# Altium project MB1134.PrjPCB
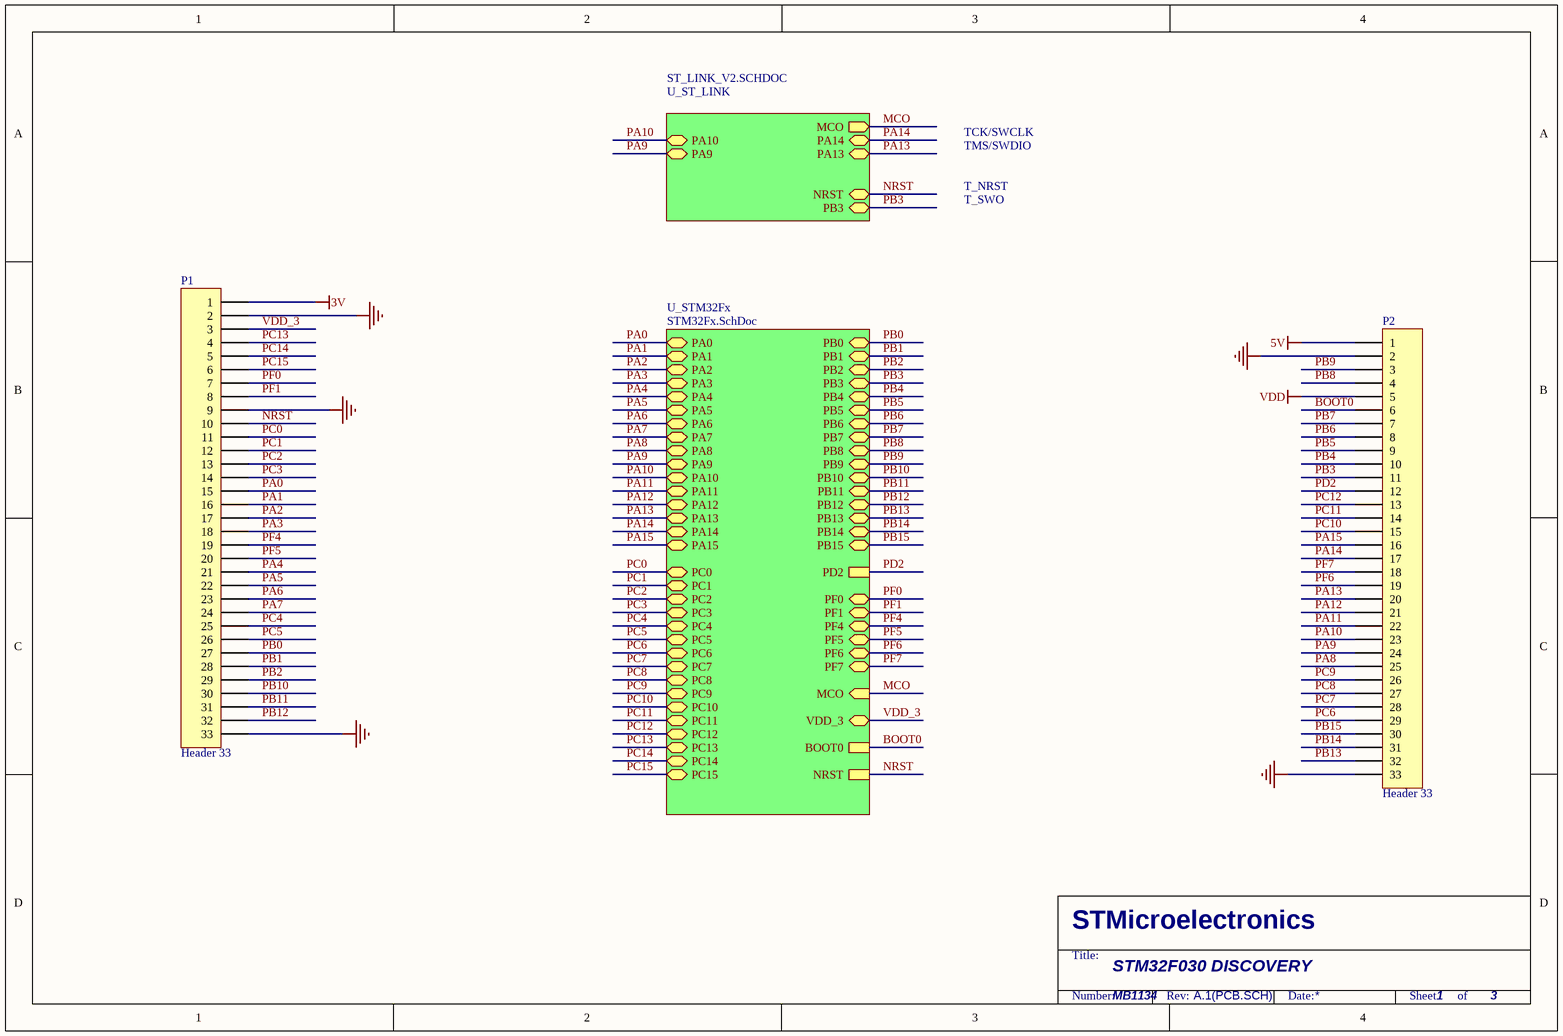
[diagram p0: MB1134.SchDoc]
3 sheets, 102 parts. Net scope: hierarchical (ports join the sheet entries above them; power ports are global).
Sheets:
  MB1134.SchDoc
    U_ST_LINK = ST_LINK_V2.SCHDOC
    U_STM32Fx = STM32Fx.SchDoc

## Sheet MB1134.SchDoc
size A4; DocumentNumber: 1; Revision: A.1(PCB.SCH); SheetNumber: 1; SheetTotal: 3; PageSetup: Record=PageOptions|CenterHorizontal=True|CenterVertical=True|PrintScale=1.00|XCorrection=1.00|YCorrection=1.00|PrintKind=1|BorderSize=5000000|LeftOffset=0|BottomOffset=0|Orientation=2|PaperLength=1000|PaperWidth=1000|Scale=100|PaperSource=15|PrintQuality=1200|MediaType=1|DitherType=10|PaperKind=A4|PrintScaleMode=1

### Parts
P1  Header 33  [HDR1X33]
P2  Header 33  [HDR1X33]

### Sub-sheets
U_ST_LINK = ST_LINK_V2.SCHDOC: PA13, PA14, NRST, PB3, MCO (out), PA10, PA9
U_STM32Fx = STM32Fx.SchDoc: PA13, PA14, PA15 (bidir), PA12 (bidir), PA0 (bidir), PA1 (bidir), PA2 (bidir), PA3 (bidir), PA4 (bidir), PA5 (bidir), PA6 (bidir), PA7 (bidir), PA8 (bidir), PA9, PA10, PA11 (bidir), PB12 (bidir), PB0 (bidir), PB1 (bidir), PB2 (bidir), PB3, PB4 (bidir), PB5 (bidir), PB6 (bidir), PB7 (bidir), PB8 (bidir), PB9 (bidir), PB10 (bidir), PB11 (bidir), PB13 (bidir), PB14 (bidir), PB15 (bidir), PC3 (bidir), PC15 (bidir), PC14 (bidir), PC13 (bidir), PC12 (bidir), PC11 (bidir), PC10 (bidir), PC9 (bidir), PC8 (bidir), PC7 (bidir), PC6 (bidir), PC5 (bidir), PC4 (bidir), PC2 (bidir), PC1 (bidir), PC0 (bidir), PD2, BOOT0, NRST, MCO (in), VDD_3, PF7, PF6, PF5, PF4, PF1, PF0

### Nets
3V: P1.1
5V: P2.1
GND: P1.2 P1.9 P1.33 P2.2 P2.33
VDD: P2.5
BOOT0: P2.6 ; sheet U_STM32Fx/BOOT0
MCO: sheet U_ST_LINK/MCO, sheet U_STM32Fx/MCO
NRST: P1.10 ; sheet U_ST_LINK/NRST, sheet U_STM32Fx/NRST
PA0: P1.15 ; sheet U_STM32Fx/PA0
PA1: P1.16 ; sheet U_STM32Fx/PA1
PA2: P1.17 ; sheet U_STM32Fx/PA2
PA3: P1.18 ; sheet U_STM32Fx/PA3
PA4: P1.21 ; sheet U_STM32Fx/PA4
PA5: P1.22 ; sheet U_STM32Fx/PA5
PA6: P1.23 ; sheet U_STM32Fx/PA6
PA7: P1.24 ; sheet U_STM32Fx/PA7
PA8: P2.25 ; sheet U_STM32Fx/PA8
PA9: P2.24 ; sheet U_ST_LINK/PA9, sheet U_STM32Fx/PA9
PA10: P2.23 ; sheet U_ST_LINK/PA10, sheet U_STM32Fx/PA10
PA11: P2.22 ; sheet U_STM32Fx/PA11
PA12: P2.21 ; sheet U_STM32Fx/PA12
PA13: P2.20 ; sheet U_ST_LINK/PA13, sheet U_STM32Fx/PA13
PA14: P2.17 ; sheet U_ST_LINK/PA14, sheet U_STM32Fx/PA14
PA15: P2.16 ; sheet U_STM32Fx/PA15
PB0: P1.27 ; sheet U_STM32Fx/PB0
PB1: P1.28 ; sheet U_STM32Fx/PB1
PB2: P1.29 ; sheet U_STM32Fx/PB2
PB3: P2.11 ; sheet U_ST_LINK/PB3, sheet U_STM32Fx/PB3
PB4: P2.10 ; sheet U_STM32Fx/PB4
PB5: P2.9 ; sheet U_STM32Fx/PB5
PB6: P2.8 ; sheet U_STM32Fx/PB6
PB7: P2.7 ; sheet U_STM32Fx/PB7
PB8: P2.4 ; sheet U_STM32Fx/PB8
PB9: P2.3 ; sheet U_STM32Fx/PB9
PB10: P1.30 ; sheet U_STM32Fx/PB10
PB11: P1.31 ; sheet U_STM32Fx/PB11
PB12: P1.32 ; sheet U_STM32Fx/PB12
PB13: P2.32 ; sheet U_STM32Fx/PB13
PB14: P2.31 ; sheet U_STM32Fx/PB14
PB15: P2.30 ; sheet U_STM32Fx/PB15
PC0: P1.11 ; sheet U_STM32Fx/PC0
PC1: P1.12 ; sheet U_STM32Fx/PC1
PC2: P1.13 ; sheet U_STM32Fx/PC2
PC3: P1.14 ; sheet U_STM32Fx/PC3
PC4: P1.25 ; sheet U_STM32Fx/PC4
PC5: P1.26 ; sheet U_STM32Fx/PC5
PC6: P2.29 ; sheet U_STM32Fx/PC6
PC7: P2.28 ; sheet U_STM32Fx/PC7
PC8: P2.27 ; sheet U_STM32Fx/PC8
PC9: P2.26 ; sheet U_STM32Fx/PC9
PC10: P2.15 ; sheet U_STM32Fx/PC10
PC11: P2.14 ; sheet U_STM32Fx/PC11
PC12: P2.13 ; sheet U_STM32Fx/PC12
PC13: P1.4 ; sheet U_STM32Fx/PC13
PC14: P1.5 ; sheet U_STM32Fx/PC14
PC15: P1.6 ; sheet U_STM32Fx/PC15
PD2: P2.12 ; sheet U_STM32Fx/PD2
PF0: P1.7 ; sheet U_STM32Fx/PF0
PF1: P1.8 ; sheet U_STM32Fx/PF1
PF4: P1.19 ; sheet U_STM32Fx/PF4
PF5: P1.20 ; sheet U_STM32Fx/PF5
PF6: P2.19 ; sheet U_STM32Fx/PF6
PF7: P2.18 ; sheet U_STM32Fx/PF7
VDD_3: P1.3 ; sheet U_STM32Fx/VDD_3

### Notes on the sheet
- TCK/SWCLK
- TMS/SWDIO
- T_SWO
- T_NRST
- STM32F030 DISCOVERY
- MB1134
- 1
- STMicroelectronics
- Title:
- Number:
- Rev:
- Date:
- Sheet       of

### Library data of the parts
P1 P2 = Header 33: Header, 33-Pin; LatestRevisionDate: 17-Jul-2002; LatestRevisionNote: Re-released for DXP Platform.; Publisher: Altium Limited

## Sheet ST_LINK_V2.SCHDOC
size A4; DocumentNumber: 2; Revision: A.1(PCB.SCH); SheetNumber: 2; SheetTotal: 3
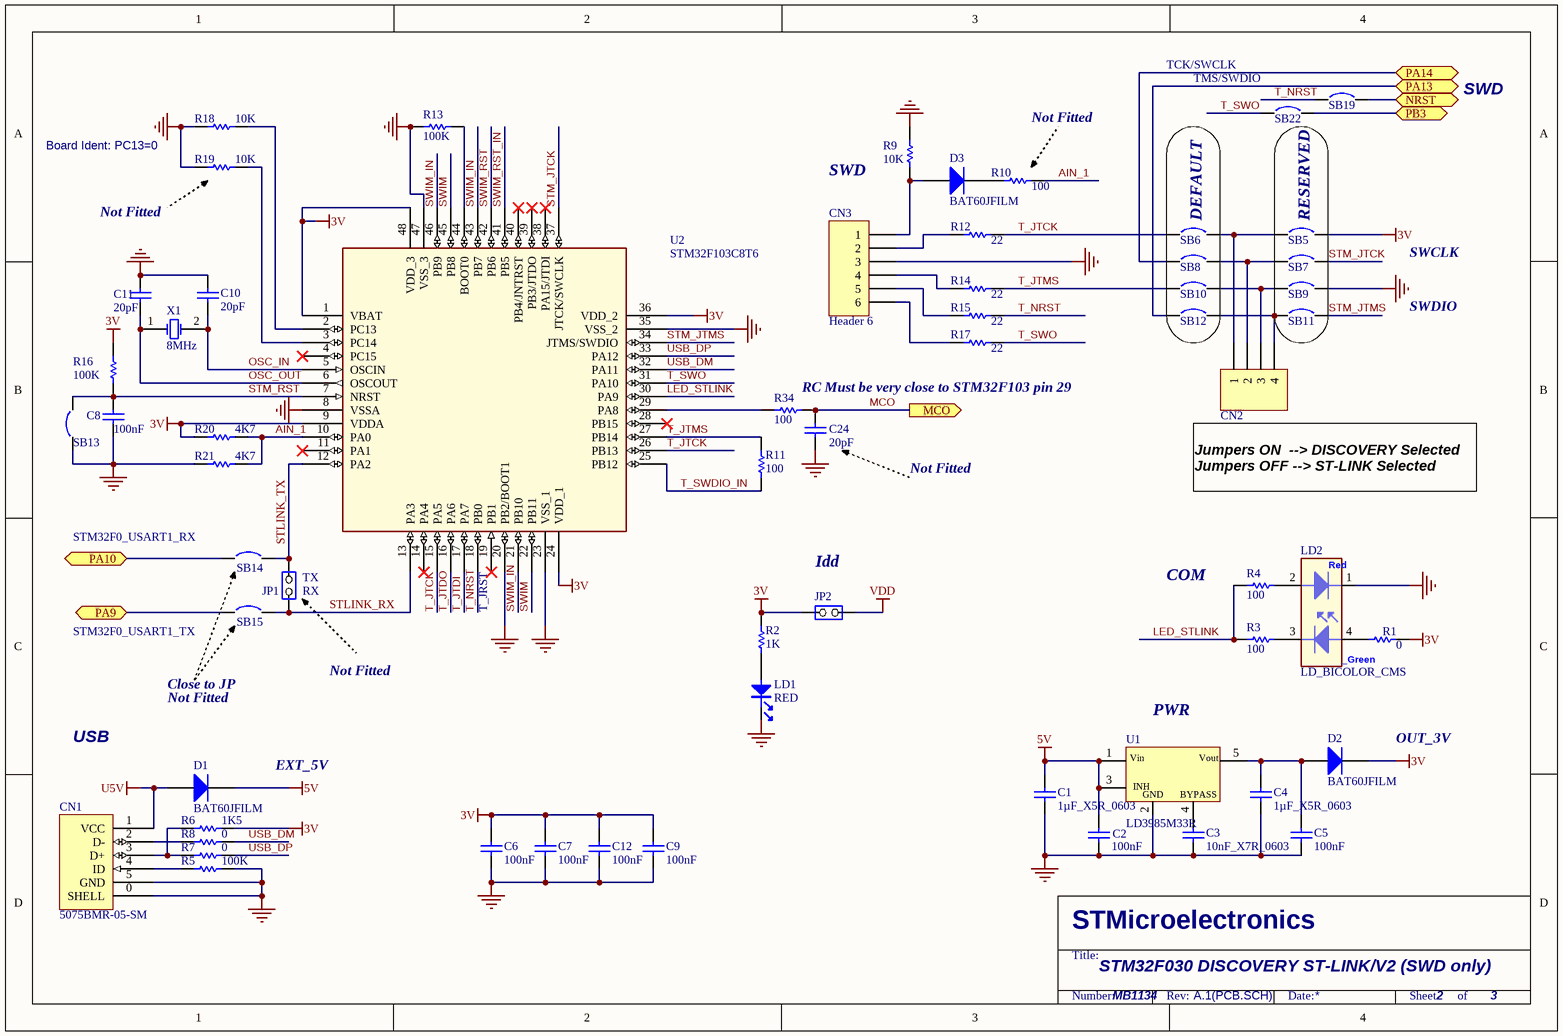
[diagram p1: ST_LINK_V2.SCHDOC]

### Parts
C1  1µF_X5R_0603  [0603C]
C2  100nF  [0603C]
C3  10nF_X7R_0603  [0603C]
C4  1µF_X5R_0603  [0603C]
C5  100nF  [0603C]
C6  100nF  [0402C]
C7  100nF  [0402C]
C8  100nF  [0402C]
C9  100nF  [0402C]
C10  20pF  [0402C]
C11  20pF  [0402C]
C12  100nF  [0402C]
C24  20pF  [0402C]
CN1  5075BMR-05-SM  [USB-MINI-B-SMD]
CN2  Header 4  [Header 4]  (value not drawn)
CN3  Header 6  [HDR1X6]
D1  BAT60JFILM  [SOD323/A]
D2  BAT60JFILM  [SOD323/A]
D3  BAT60JFILM  [SOD323/A]
JP1  (no value)  [SIP2/2.54]
JP2  (no value)  [SIP2/2.54]
LD1  RED  [0603D]
LD2  LD_BICOLOR_CMS  [HSMF-A201]
R1  0  [0402R]
R2  1K  [0402R]
R3  100  [0402R]
R4  100  [0402R]
R5  100K  [0402R]
R6  1K5  [0402R]
R7  0  [0603R-GS]
R8  0  [0603R-GS]
R9  10K  [0402R]
R10  100  [0402R]
R11  100  [0402R]
R12  22  [0402R]
R13  100K  [0402R]
R14  22  [0402R]
R15  22  [0402R]
R16  100K  [0402R]
R17  22  [0402R]
R18  10K  [0402R]
R19  10K  [0402R]
R20  4K7  [0402R]
R21  4K7  [0402R]
R34  100  [0402R]
SB5  Circuit Breaker  [JP2_SMD]  (value not drawn)
SB6  Circuit Breaker  [JP2_SMD]  (value not drawn)
SB7  Circuit Breaker  [JP2_SMD]  (value not drawn)
SB8  Circuit Breaker  [JP2_SMD]  (value not drawn)
SB9  Circuit Breaker  [JP2_SMD]  (value not drawn)
SB10  Circuit Breaker  [JP2_SMD]  (value not drawn)
SB11  Circuit Breaker  [JP2_SMD]  (value not drawn)
SB12  Circuit Breaker  [JP2_SMD]  (value not drawn)
SB13  Circuit Breaker  [JP2_SMD]  (value not drawn)
SB14  Circuit Breaker  [JP2_SMD]  (value not drawn)
SB15  Circuit Breaker  [JP2_SMD]  (value not drawn)
SB19  Circuit Breaker  [JP2_SMD]  (value not drawn)
SB22  Circuit Breaker  [JP2_SMD]  (value not drawn)
U1  LD3985M33R  [SOT-23-5L]
U2  STM32F103C8T6  [QFP48 7X7]
X1  8MHz  [XTAL1]

### Blocks framed on the sheet
DEFAULT: SB6 SB8 SB10 SB12
RESERVED: SB5 SB7 SB9 SB11

### Ports
MCO (out), NRST, PA9, PA10, PA13, PA14, PB3

### Nets
3V: C6.2 C7.2 C9.2 C12.1 D2.2(K) JP2.1(COMMON) R1.2 R2.2 R6.2 R16.2 R20.1 SB5.2 U2.1(VBAT) U2.9(VDDA) U2.24(VDD_1) U2.36(VDD_2) U2.48(VDD_3)
5V: C1.2 C2.2 D1.2(K) U1.1(Vin) U1.3(CE)
GND: C1.1 C2.1 C3.1 C4.2 C5.1 C6.1 C7.1 C8.1 C9.1 C10.1 C11.1 C12.2 C24.2 CN1.0(SHELL) CN1.5(GND) CN3.3 LD1.2 LD2.1 R5.2 R9.2 R13.1 R18.1 R19.1 R21.1 SB9.2 SB13.1 U1.2(GND) U2.8(VSSA) U2.20(PB2/BOOT1) U2.23(VSS_1) U2.35(VSS_2) U2.47(VSS_3)
U5V: CN1.1(VCC) D1.1(A)
VDD: JP2.2(NO)
AIN_1: R10.2 R20.2 R21.2 U2.10(PA0)
LED_STLINK: R3.1 R4.1 U2.30(PA9)
MCO: C24.1 R34.2 ; port MCO
NRST: SB19.2 ; port NRST
OSC_IN: C10.2 U2.5(OSCIN) X1.2(OSC2)
OSC_OUT: C11.2 U2.6(OSCOUT) X1.1(OSC1)
PA9: SB15.1 ; port PA9
PA10: SB14.1 ; port PA10
PA13: SB12.1 ; port PA13
PA14: SB8.1 ; port PA14
PB3: SB22.2 ; port PB3
STLINK_RX: JP1.1(COMMON) SB15.2 U2.13(PA3)
STLINK_TX: JP1.2(NO) SB14.2 U2.12(PA2)
STM_JTCK: SB7.2 U2.37(JTCK/SWCLK)
STM_JTMS: SB11.2 U2.34(JTMS/SWDIO)
STM_RST: C8.2 R16.1 SB13.2 U2.7(NRST)
SWIM: U2.22(PB11) U2.45(PB8)
SWIM_IN: U2.21(PB10) U2.43(PB7) U2.46(PB9)
SWIM_RST: U2.42(PB6)
SWIM_RST_IN: U2.41(PB5)
T_JTCK: R12.2 SB6.1 U2.15(PA5) U2.26(PB13)
T_JTDI: U2.17(PA7)
T_JTDO: U2.16(PA6)
T_JTMS: R11.2 R14.2 SB10.1 U2.27(PB14)
T_NRST: R15.2 SB19.1 U2.18(PB0)
T_SWDIO_IN: R11.1 U2.25(PB12)
T_SWO: R17.2 SB22.1 U2.31(PA10)
USB_DM: R8.2 U2.32(PA11)
USB_DP: R7.2 U2.33(PA12)
NetC3_2: C3.2 U1.4(BYPASS)
NetC4_1: C4.1 C5.2 D2.1(A) U1.5(Vout)
NetCN1_2: CN1.2(D-) R8.1
NetCN1_3: CN1.3(D+) R6.1 R7.1
NetCN1_4: CN1.4(ID) R5.1
NetCN2_1: CN2.1 SB5.1 SB6.2
NetCN2_2: CN2.2 SB7.1 SB8.2
NetCN2_3: CN2.3 SB9.1 SB10.2
NetCN2_4: CN2.4 SB11.1 SB12.2
NetCN3_1: CN3.1 D3.1(A) R9.1
NetCN3_2: CN3.2 R12.1
NetCN3_4: CN3.4 R14.1
NetCN3_5: CN3.5 R15.1
NetCN3_6: CN3.6 R17.1
NetD3_2: D3.2(K) R10.1
NetLD1_1: LD1.1 R2.1
NetLD2_2: LD2.2 R4.2
NetLD2_3: LD2.3 R3.2
NetLD2_4: LD2.4 R1.1
NetR13_2: R13.2 U2.44(BOOT0)
NetR18_2: R18.2 U2.2(PC13)
NetR19_2: R19.2 U2.3(PC14)
NetR34_1: R34.1 U2.29(PA8)

Not connected (* = marked no-connect by the designer): U2 4(PC15)* 11(PA1)* 14(PA4)* 19(PB1)* 28(PB15)* 38(PA15/JTDI)* 39(PB3/JTDO)* 40(PB4/JNTRST)*

### Notes on the sheet
- TCK/SWCLK
- (near SB22) TMS/SWDIO
- SWD
- Board Ident: PC13=0
- Not Fitted
- SWCLK
- SWDIO
- (near R34) RC Must be very close to STM32F103 pin 29
- Jumpers ON  --> DISCOVERY Selected
  Jumpers OFF --> ST-LINK Selected
- STM32F0_USART1_RX
- (near JP1) TX
- (near JP2) Idd
- COM
- STM32F0_USART1_TX
- (near JP1) RX
- (near U2) T_JRST
- Close to JP
- (near U1) PWR
- USB
- EXT_5V
- OUT_3V
- STM32F030 DISCOVERY ST-LINK/V2 (SWD only)
- MB1134
- STMicroelectronics
- Title:
- Number:
- Rev:
- Date:
- Sheet       of
- (in symbol LD3985M33R) INH
- (in symbol LD_BICOLOR_CMS) Red; _Green

### Library data of the parts
C1 C4 = CAP SMD 0603  X5R 1µF 25V 10%: 0603  X5R 1µF; Rated voltage: 25V; Tolerance: 10%; Manufacturer: *; Manufacturer P/N: *; Order code Farnell: 1288202RL; Value: 1µF; Power: *; Technology: X5R; Temperature  Factor: *; Temperature Max: +125°C; Temperature Min: -55°C; STS Code: *
C2 C5-C12 = Cap: Capacitor; Published: 8-Jun-2000; Revision: July-2002: Re-released for DXP Platform.; Publisher: Altium Limited
  C2 C5-C9 C12: Value: 100nF
  C10 C11: Value: 20pF
C3 = CAP SMD 0603  X7R 10000PF 50V 10%: 0603  X7R 10NF; Order code RS: 2040779; Rated voltage: 50V; Tolerance: 10%; Order code Farnell: 7569548RL; Value: 10NF; Power: *; Technology: X7R; Temperature Factor: *; Temperature Min: -55°C; Temperature Max: +125°C; STS Code: *
C24 = Cap: Capacitor; Fitted: NO; Published: 8-Jun-2000; Publisher: Altium Limited; Value: 20pF; Revision: July-2002: Re-released for DXP Platform.
CN1 = USB-MINI-typeB connector
CN2 = Header 4: Header, 4-Pin; Description: Header 4x1 with 2 Jumpers; Revision: 17-Jul-2002: Re-released for DXP Platform.; Publisher: Altium Limited
CN3 = Header 6: Header, 6-Pin; LatestRevisionDate: 17-Jul-2002; LatestRevisionNote: Re-released for DXP Platform.; Publisher: Altium Limited
D1-D3 = BAT60JFILM: Manuf_1: STM; Code - JEDEC: DO-214-AB; Provided: ST; Published: 8-Jun-2000; Revision: July-2002: Re-released for DXP Platform.; Publisher: Altium Limited; Order: BAT60JFILM; Manuf_Part_1: BAT60JFILM; Distrib: ST
JP1 = JP2: Fitted: NO
JP2 = JP2: Description: Header 2x1 with Jumper
LD1 = PHOTO
LD2 = LD_BICOLOR_CMS: Bicolor Led; Manuf_Part_1: HSMF-A201-A00J1; Manuf_1: Avago Technologies; Ref St: xxxxxx; cap_dec: ----; Distrib: RADIOSPARES; support: ----
R1-R6 R9 R11-R18 R20 R21 R34 = res1: Resistor; Published: 8-Jun-2000; Revision: July-2002: Re-released for DXP Platform.; Publisher: Altium Limited
  R1: Value: 0
  R2: Value: 1K
  R3 R4 R11 R34: Value: 100
  R5 R13 R16: Value: 100K
  R6: Value: 1K5
  R9 R18: Value: 10K
  R12 R14 R15 R17: Value: 22
  R20 R21: Value: 4K7
R7 R8 = res1: Resistor; Value: 10; Published: 8-Jun-2000; Revision: July-2002: Re-released for DXP Platform.; Publisher: Altium Limited
R10 R19 = res1: Resistor; Fitted: NO; Published: 8-Jun-2000; Revision: July-2002: Re-released for DXP Platform.; Publisher: Altium Limited
  R10: Value: 100
  R19: Value: 10K
SB5 SB7 SB9 SB11 SB19 SB22 = Circuit Breaker: Solder: YES; Published: 24-Mar-1999; Revision: July-2002: Re-released for DXP Platform.; Publisher: Altium Limited
SB6 SB8 SB10 SB12-SB15 = Circuit Breaker: Solder: NO; Published: 24-Mar-1999; Revision: July-2002: Re-released for DXP Platform.; Publisher: Altium Limited
U1 = LD3985M33R: Ultra low drop-low noise BiCMOS voltage, regulators low ESR capacitors compatible; Manuf_1: STM; Provided: ST; Ref St: 9176161; Manuf_Part_1: LD3985M33R; Distrib: ST; Order: LD3985M33R
U2 = STM32F103C8T6: Medium-density performance line ARM-based 32-bit MCU with 64KB Flash, USB, CAN, 7 timers, 2 ADCs; Manuf_1: STM; Ref St: 9175981; Provided: ST; Manuf_Part_1: STM32F103C8T6; Order: STM32F103C8T6; Distrib: ST
X1 = XTAL: Crystal Oscillator; Published: 8-Jun-2000; LatestRevisionDate: 17-Jul-2002; LatestRevisionNote: Re-released for DXP Platform.; PackageReference: R38; Publisher: Altium Limited

## Sheet STM32Fx.SchDoc
size A4; DocumentNumber: 3; Revision: A.1(PCB.SCH); SheetNumber: 3; SheetTotal: 3
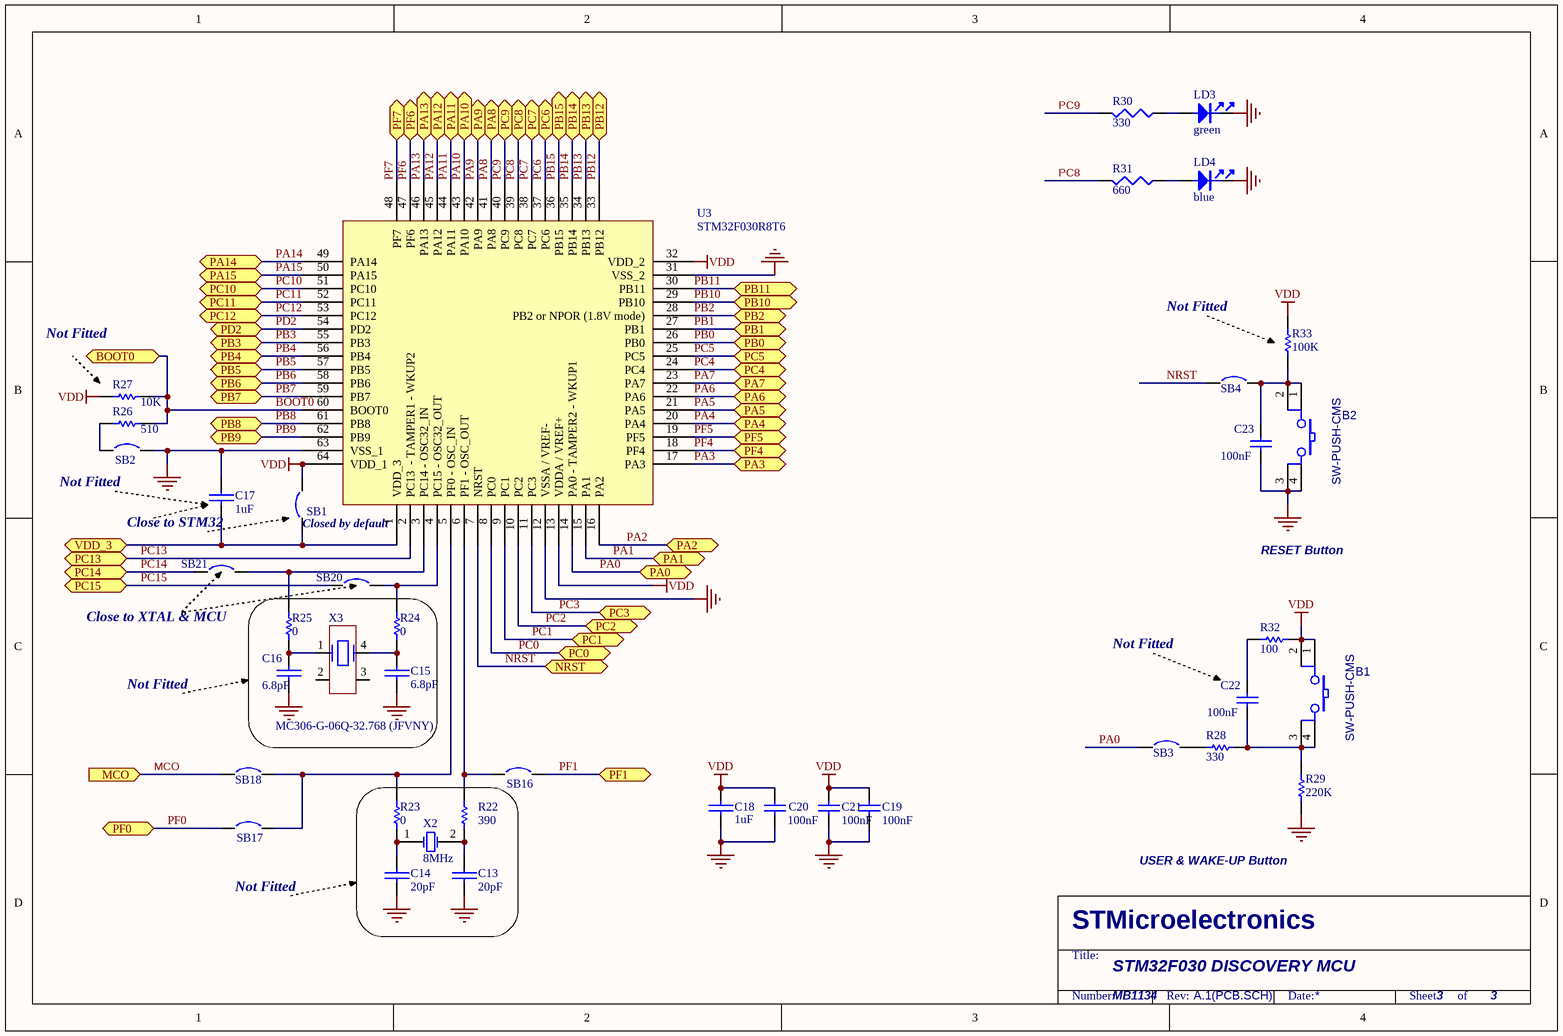
[diagram p2: STM32Fx.SchDoc]

### Parts
B1  SW-PUSH-CMS  [BP1CMS]
B2  SW-PUSH-CMS  [BP1CMS]
C13  20pF  [0603C]
C14  20pF  [0603C]
C15  6.8pF  [0603C]
C16  6.8pF  [0603C]
C17  1uF  [0603C]
C18  1uF  [0603C]
C19  100nF  [0603C]
C20  100nF  [0603C]
C21  100nF  [0603C]
C22  100nF  [0603C]
C23  100nF  [0603C]
LD3  green  [0603D]
LD4  blue  [0603D]
R22  390  [0603R]
R23  0  [0603R-GS]
R24  0  [0603R-GS]
R25  0  [0603R-GS]
R26  510  [0603R]
R27  10K  [0603R]
R28  330  [0402R]
R29  220K  [0603R]
R30  330  [0603R]
R31  660  [0603R]
R32  100  [0402R]
R33  100K  [0402R]
SB1  Circuit Breaker  [JP2_SMD]  (value not drawn)
SB2  Circuit Breaker  [JP2_SMD]  (value not drawn)
SB3  Circuit Breaker  [JP2_SMD]  (value not drawn)
SB4  Circuit Breaker  [JP2_SMD]  (value not drawn)
SB16  Circuit Breaker  [JP2_SMD]  (value not drawn)
SB17  Circuit Breaker  [JP2_SMD]  (value not drawn)
SB18  Circuit Breaker  [JP2_SMD]  (value not drawn)
SB20  Circuit Breaker  [JP2_SMD]  (value not drawn)
SB21  Circuit Breaker  [JP2_SMD]  (value not drawn)
U3  STM32F030R8T6  [LQFP64]
X2  8MHz  [XTAL1]
X3  MC306-G-06Q-32.768 (JFVNY)  [MC306-CRYSTAL]

### Ports
BOOT0, MCO (in), NRST, PA0 (bidir), PA1 (bidir), PA2 (bidir), PA3 (bidir), PA4 (bidir), PA5 (bidir), PA6 (bidir), PA7 (bidir), PA8, PA9, PA10, PA11, PA12, PA13, PA14 (bidir), PA15 (bidir), PB0 (bidir), PB1 (bidir), PB2 (bidir), PB3, PB4 (bidir), PB5 (bidir), PB6 (bidir), PB7 (bidir), PB8 (bidir), PB9 (bidir), PB10 (bidir), PB11 (bidir), PB12 (bidir), PB13 (bidir), PB14 (bidir), PB15 (bidir), PC0 (bidir), PC1 (bidir), PC2 (bidir), PC3 (bidir), PC4 (bidir), PC5 (bidir), PC6 (bidir), PC7 (bidir), PC8 (bidir), PC9 (bidir), PC10 (bidir), PC11 (bidir), PC12 (bidir), PC13 (bidir), PC14 (bidir), PC15 (bidir), PD2, PF0, PF1, PF4, PF5, PF6, PF7, VDD_3

### Nets
GND: B2.3 B2.4 C13.2 C14.2 C15.2 C16.2 C17.1 C18.2 C19.2 C20.2 C21.2 C23.1 LD3.2 LD4.2 R29.1 SB2.2 U3.12(VSSA_/_VREF-) U3.31(VSS_2) U3.63(VSS_1)
VDD: B1.1 B1.2 C18.1 C19.1 C20.1 C21.1 R27.1 R32.2 R33.2 SB1.2 U3.13(VDDA_/_VREF+) U3.32(VDD_2) U3.64(VDD_1)
BOOT0: R26.2 R27.2 U3.60(BOOT0) ; port BOOT0
MCO: SB18.1 ; port MCO
NRST: SB4.1 U3.7(NRST) ; port NRST
PA0: SB3.1 U3.14(PA0_-_TAMPER2_-_WKUP1) ; port PA0
PA1: U3.15(PA1) ; port PA1
PA2: U3.16(PA2) ; port PA2
PA3: U3.17(PA3) ; port PA3
PA4: U3.20(PA4) ; port PA4
PA5: U3.21(PA5) ; port PA5
PA6: U3.22(PA6) ; port PA6
PA7: U3.23(PA7) ; port PA7
PA8: U3.41(PA8) ; port PA8
PA9: U3.42(PA9) ; port PA9
PA10: U3.43(PA10) ; port PA10
PA11: U3.44(PA11) ; port PA11
PA12: U3.45(PA12) ; port PA12
PA13: U3.46(PA13) ; port PA13
PA14: U3.49(PA14) ; port PA14
PA15: U3.50(PA15) ; port PA15
PB0: U3.26(PB0) ; port PB0
PB1: U3.27(PB1) ; port PB1
PB2: U3.28(PB2_or_NPOR_(1.8V_mode)) ; port PB2
PB3: U3.55(PB3) ; port PB3
PB4: U3.56(PB4) ; port PB4
PB5: U3.57(PB5) ; port PB5
PB6: U3.58(PB6) ; port PB6
PB7: U3.59(PB7) ; port PB7
PB8: U3.61(PB8) ; port PB8
PB9: U3.62(PB9) ; port PB9
PB10: U3.29(PB10) ; port PB10
PB11: U3.30(PB11) ; port PB11
PB12: U3.33(PB12) ; port PB12
PB13: U3.34(PB13) ; port PB13
PB14: U3.35(PB14) ; port PB14
PB15: U3.36(PB15) ; port PB15
PC0: U3.8(PC0) ; port PC0
PC1: U3.9(PC1) ; port PC1
PC2: U3.10(PC2) ; port PC2
PC3: U3.11(PC3) ; port PC3
PC4: U3.24(PC4) ; port PC4
PC5: U3.25(PC5) ; port PC5
PC6: U3.37(PC6) ; port PC6
PC7: U3.38(PC7) ; port PC7
PC8: R31.2 U3.39(PC8) ; port PC8
PC9: R30.2 U3.40(PC9) ; port PC9
PC10: U3.51(PC10) ; port PC10
PC11: U3.52(PC11) ; port PC11
PC12: U3.53(PC12) ; port PC12
PC13: U3.2(PC13__-_TAMPER1_-_WKUP2) ; port PC13
PC14: SB21.1 ; port PC14
PC15: SB20.1 ; port PC15
PD2: U3.54(PD2) ; port PD2
PF0: SB17.1 ; port PF0
PF1: SB16.2 ; port PF1
PF4: U3.18(PF4) ; port PF4
PF5: U3.19(PF5) ; port PF5
PF6: U3.47(PF6) ; port PF6
PF7: U3.48(PF7) ; port PF7
VDD_3: C17.2 SB1.1 U3.1(VDD_3) ; port VDD_3
NetB1_3: B1.3 B1.4 C22.1 R28.2 R29.2
NetB2_1: B2.1 B2.2 C23.2 R33.1 SB4.2
NetC13_1: C13.1 R22.2 X2.2(OSC2)
NetC14_1: C14.1 R23.1 X2.1(OSC1)
NetC15_1: C15.1 R24.1 X3.4
NetC16_1: C16.1 R25.1 X3.1
NetC22_2: C22.2 R32.1
NetLD3_1: LD3.1 R30.1
NetLD4_1: LD4.1 R31.1
NetR22_1: R22.1 SB16.1 U3.6(PF1_-_OSC_OUT)
NetR23_2: R23.2 SB17.2 SB18.2 U3.5(PF0_-_OSC_IN)
NetR24_2: R24.2 SB20.2 U3.4(PC15_-_OSC32_OUT)
NetR25_2: R25.2 SB21.2 U3.3(PC14_-_OSC32_IN)
NetR26_1: R26.1 SB2.1
NetR28_1: R28.1 SB3.2

Not connected (* = marked no-connect by the designer): X3 2 3

### Notes on the sheet
- Not Fitted
- (near SB2) Not Fitted
- (near C17) Close to STM32
- (near SB1) Closed by default
- RESET Button
- (near SB21) Close to XTAL & MCU
- (near SB17) Not Fitted
- USER & WAKE-UP Button
- STM32F030 DISCOVERY MCU
- MB1134
- STMicroelectronics
- Title:
- Number:
- Rev:
- Date:
- Sheet       of

### Library data of the parts
B1 B2 = SW-PUSH-CMS: Non-Open Push-Button 0.1A 24V; Manuf_Part_1: TD-0341; Ref St: ********; cap_dec: ---; Manuf_1: http://www.xiejia.net/
C13-C17 C22 = CAP: Capacitor; Fitted: NO
  C22: Published: 8-Jun-2000; Revision: July-2002: Re-released for DXP Platform.; Publisher: Altium Limited; Value: 100nF
C18 C23 = CAP: Capacitor
  C23: Published: 8-Jun-2000; Revision: July-2002: Re-released for DXP Platform.; Publisher: Altium Limited; Value: 100nF
C19-C21 = Cap: Capacitor; Value: 10nF; Published: 8-Jun-2000; Revision: July-2002: Re-released for DXP Platform.; Publisher: Altium Limited
LD3 LD4 = PHOTO
R22 = Res1: Resistor; Value: 0; Fitted: NO; Published: 8-Jun-2000; Revision: July-2002: Re-released for DXP Platform.; Publisher: Altium Limited
R23-R25 = Res1: Resistor; Fitted: NO; Published: 8-Jun-2000; Revision: July-2002: Re-released for DXP Platform.; Publisher: Altium Limited; Value: 0
R26 = Res1: Resistor; Published: 8-Jun-2000; Revision: July-2002: Re-released for DXP Platform.; Publisher: Altium Limited; Value: 510
R27 R33 = res1: Resistor; Fitted: NO; Published: 8-Jun-2000; Revision: July-2002: Re-released for DXP Platform.; Publisher: Altium Limited
  R27: Value: 10K
  R33: Value: 100K
R28 = res1: Resistor; Published: 8-Jun-2000; Revision: July-2002: Re-released for DXP Platform.; Publisher: Altium Limited; Value: 330
R29 = res1: Resistor; Value: 10K; Published: 8-Jun-2000; Revision: July-2002: Re-released for DXP Platform.; Publisher: Altium Limited
R30 R31 = RES1
R32 = res1: Resistor; Value: 330; Published: 8-Jun-2000; Revision: July-2002: Re-released for DXP Platform.; Publisher: Altium Limited
SB1-SB4 SB16 SB18 SB20 SB21 = Circuit Breaker: Solder: YES; Published: 24-Mar-1999; Revision: July-2002: Re-released for DXP Platform.; Publisher: Altium Limited
SB17 = Circuit Breaker: Solder: NO; Published: 24-Mar-1999; Revision: July-2002: Re-released for DXP Platform.; Publisher: Altium Limited
U3 = STM32F030R8T6: Advanced ARM based 32-bit Cortex M0 MCU with 64 Kbytes Flash and 8 Kbytes of SRAM; Manuf_1: STM; Manuf_Part_1: STM32F051R8T6; Description: Advanced ARM based 32-bit Cortex?M0 MCU with 64 Kbytes Flash and 8 Kbytes of SRAM; Provided: ST; Order: STM32F051R8T6; Distrib: ST
X2 = XTAL: Crystal Oscillator; Fitted: NO; Published: 8-Jun-2000; LatestRevisionDate: 17-Jul-2002; LatestRevisionNote: Re-released for DXP Platform.; PackageReference: R38; Publisher: Altium Limited
X3 = MC306: Fitted: NO

## Nets that join several sheets
3V: MB1134 (P1.1), ST_LINK_V2 (17 pins)
5V: MB1134 (P2.1), ST_LINK_V2 (5 pins)
GND: MB1134 (5 pins), ST_LINK_V2 (32 pins), STM32Fx (19 pins)
VDD: MB1134 (P2.5), ST_LINK_V2 (JP2.2), STM32Fx (13 pins)
BOOT0: MB1134 (P2.6), STM32Fx (R26.2 R27.2 U3.60)
MCO: ST_LINK_V2 (C24.1 R34.2), STM32Fx (SB18.1)
NRST: MB1134 (P1.10), ST_LINK_V2 (SB19.2), STM32Fx (SB4.1 U3.7)
PA0: MB1134 (P1.15), STM32Fx (SB3.1 U3.14)
PA1: MB1134 (P1.16), STM32Fx (U3.15)
PA2: MB1134 (P1.17), STM32Fx (U3.16)
PA3: MB1134 (P1.18), STM32Fx (U3.17)
PA4: MB1134 (P1.21), STM32Fx (U3.20)
PA5: MB1134 (P1.22), STM32Fx (U3.21)
PA6: MB1134 (P1.23), STM32Fx (U3.22)
PA7: MB1134 (P1.24), STM32Fx (U3.23)
PA8: MB1134 (P2.25), STM32Fx (U3.41)
PA9: MB1134 (P2.24), ST_LINK_V2 (SB15.1), STM32Fx (U3.42)
PA10: MB1134 (P2.23), ST_LINK_V2 (SB14.1), STM32Fx (U3.43)
PA11: MB1134 (P2.22), STM32Fx (U3.44)
PA12: MB1134 (P2.21), STM32Fx (U3.45)
PA13: MB1134 (P2.20), ST_LINK_V2 (SB12.1), STM32Fx (U3.46)
PA14: MB1134 (P2.17), ST_LINK_V2 (SB8.1), STM32Fx (U3.49)
PA15: MB1134 (P2.16), STM32Fx (U3.50)
PB0: MB1134 (P1.27), STM32Fx (U3.26)
PB1: MB1134 (P1.28), STM32Fx (U3.27)
PB2: MB1134 (P1.29), STM32Fx (U3.28)
PB3: MB1134 (P2.11), ST_LINK_V2 (SB22.2), STM32Fx (U3.55)
PB4: MB1134 (P2.10), STM32Fx (U3.56)
PB5: MB1134 (P2.9), STM32Fx (U3.57)
PB6: MB1134 (P2.8), STM32Fx (U3.58)
PB7: MB1134 (P2.7), STM32Fx (U3.59)
PB8: MB1134 (P2.4), STM32Fx (U3.61)
PB9: MB1134 (P2.3), STM32Fx (U3.62)
PB10: MB1134 (P1.30), STM32Fx (U3.29)
PB11: MB1134 (P1.31), STM32Fx (U3.30)
PB12: MB1134 (P1.32), STM32Fx (U3.33)
PB13: MB1134 (P2.32), STM32Fx (U3.34)
PB14: MB1134 (P2.31), STM32Fx (U3.35)
PB15: MB1134 (P2.30), STM32Fx (U3.36)
PC0: MB1134 (P1.11), STM32Fx (U3.8)
PC1: MB1134 (P1.12), STM32Fx (U3.9)
PC2: MB1134 (P1.13), STM32Fx (U3.10)
PC3: MB1134 (P1.14), STM32Fx (U3.11)
PC4: MB1134 (P1.25), STM32Fx (U3.24)
PC5: MB1134 (P1.26), STM32Fx (U3.25)
PC6: MB1134 (P2.29), STM32Fx (U3.37)
PC7: MB1134 (P2.28), STM32Fx (U3.38)
PC8: MB1134 (P2.27), STM32Fx (R31.2 U3.39)
PC9: MB1134 (P2.26), STM32Fx (R30.2 U3.40)
PC10: MB1134 (P2.15), STM32Fx (U3.51)
PC11: MB1134 (P2.14), STM32Fx (U3.52)
PC12: MB1134 (P2.13), STM32Fx (U3.53)
PC13: MB1134 (P1.4), STM32Fx (U3.2)
PC14: MB1134 (P1.5), STM32Fx (SB21.1)
PC15: MB1134 (P1.6), STM32Fx (SB20.1)
PD2: MB1134 (P2.12), STM32Fx (U3.54)
PF0: MB1134 (P1.7), STM32Fx (SB17.1)
PF1: MB1134 (P1.8), STM32Fx (SB16.2)
PF4: MB1134 (P1.19), STM32Fx (U3.18)
PF5: MB1134 (P1.20), STM32Fx (U3.19)
PF6: MB1134 (P2.19), STM32Fx (U3.47)
PF7: MB1134 (P2.18), STM32Fx (U3.48)
VDD_3: MB1134 (P1.3), STM32Fx (C17.2 SB1.1 U3.1)